# EAGLE schematic memory_logic (EAGLE 6.4)
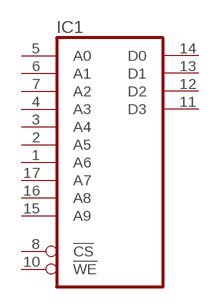
[diagram p0: schematic, sheet 1]

## Parts
IC1  2114  [DIL18]
Unconnected: IC1.1(A6) IC1.2(A5) IC1.3(A4) IC1.4(A3) IC1.5(A0) IC1.6(A1) IC1.7(A2) IC1.8(!CS) IC1.10(!WE) IC1.11(D3) IC1.12(D2) IC1.13(D1) IC1.14(D0) IC1.15(A9) IC1.16(A8) IC1.17(A7)

## Power pins joined to a net without a drawn wire
GND: IC1.9(GND)
VCC: IC1.18(VCC)

## Library data of the parts
IC1 = memory:2114: MEMORY